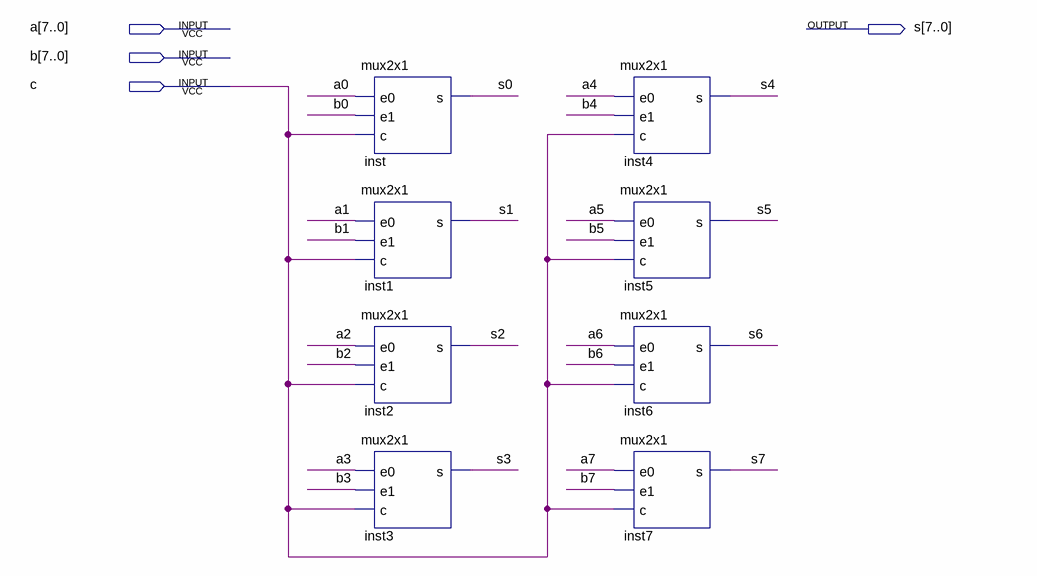
[diagram p0: schematic sheet]
// Quartus schematic mux2x1_8bits.bdf as structural Verilog: 8 symbols, 4 pins
module mux2x1_8bits (
  input  [7:0] a,
  input  [7:0] b,
  input  c,
  output [7:0] s
);

  mux2x1 inst (.e0(a[0]), .e1(b[0]), .c(c), .s(s[0]));
  mux2x1 inst1 (.e0(a[1]), .e1(b[1]), .c(c), .s(s[1]));
  mux2x1 inst2 (.e0(a[2]), .e1(b[2]), .c(c), .s(s[2]));
  mux2x1 inst3 (.e0(a[3]), .e1(b[3]), .c(c), .s(s[3]));
  mux2x1 inst4 (.e0(a[4]), .e1(b[4]), .c(c), .s(s[4]));
  mux2x1 inst5 (.e0(a[5]), .e1(b[5]), .c(c), .s(s[5]));
  mux2x1 inst6 (.e0(a[6]), .e1(b[6]), .c(c), .s(s[6]));
  mux2x1 inst7 (.e0(a[7]), .e1(b[7]), .c(c), .s(s[7]));
endmodule
